# EAGLE design FioSwitchboard-v2 (EAGLE 5.10)
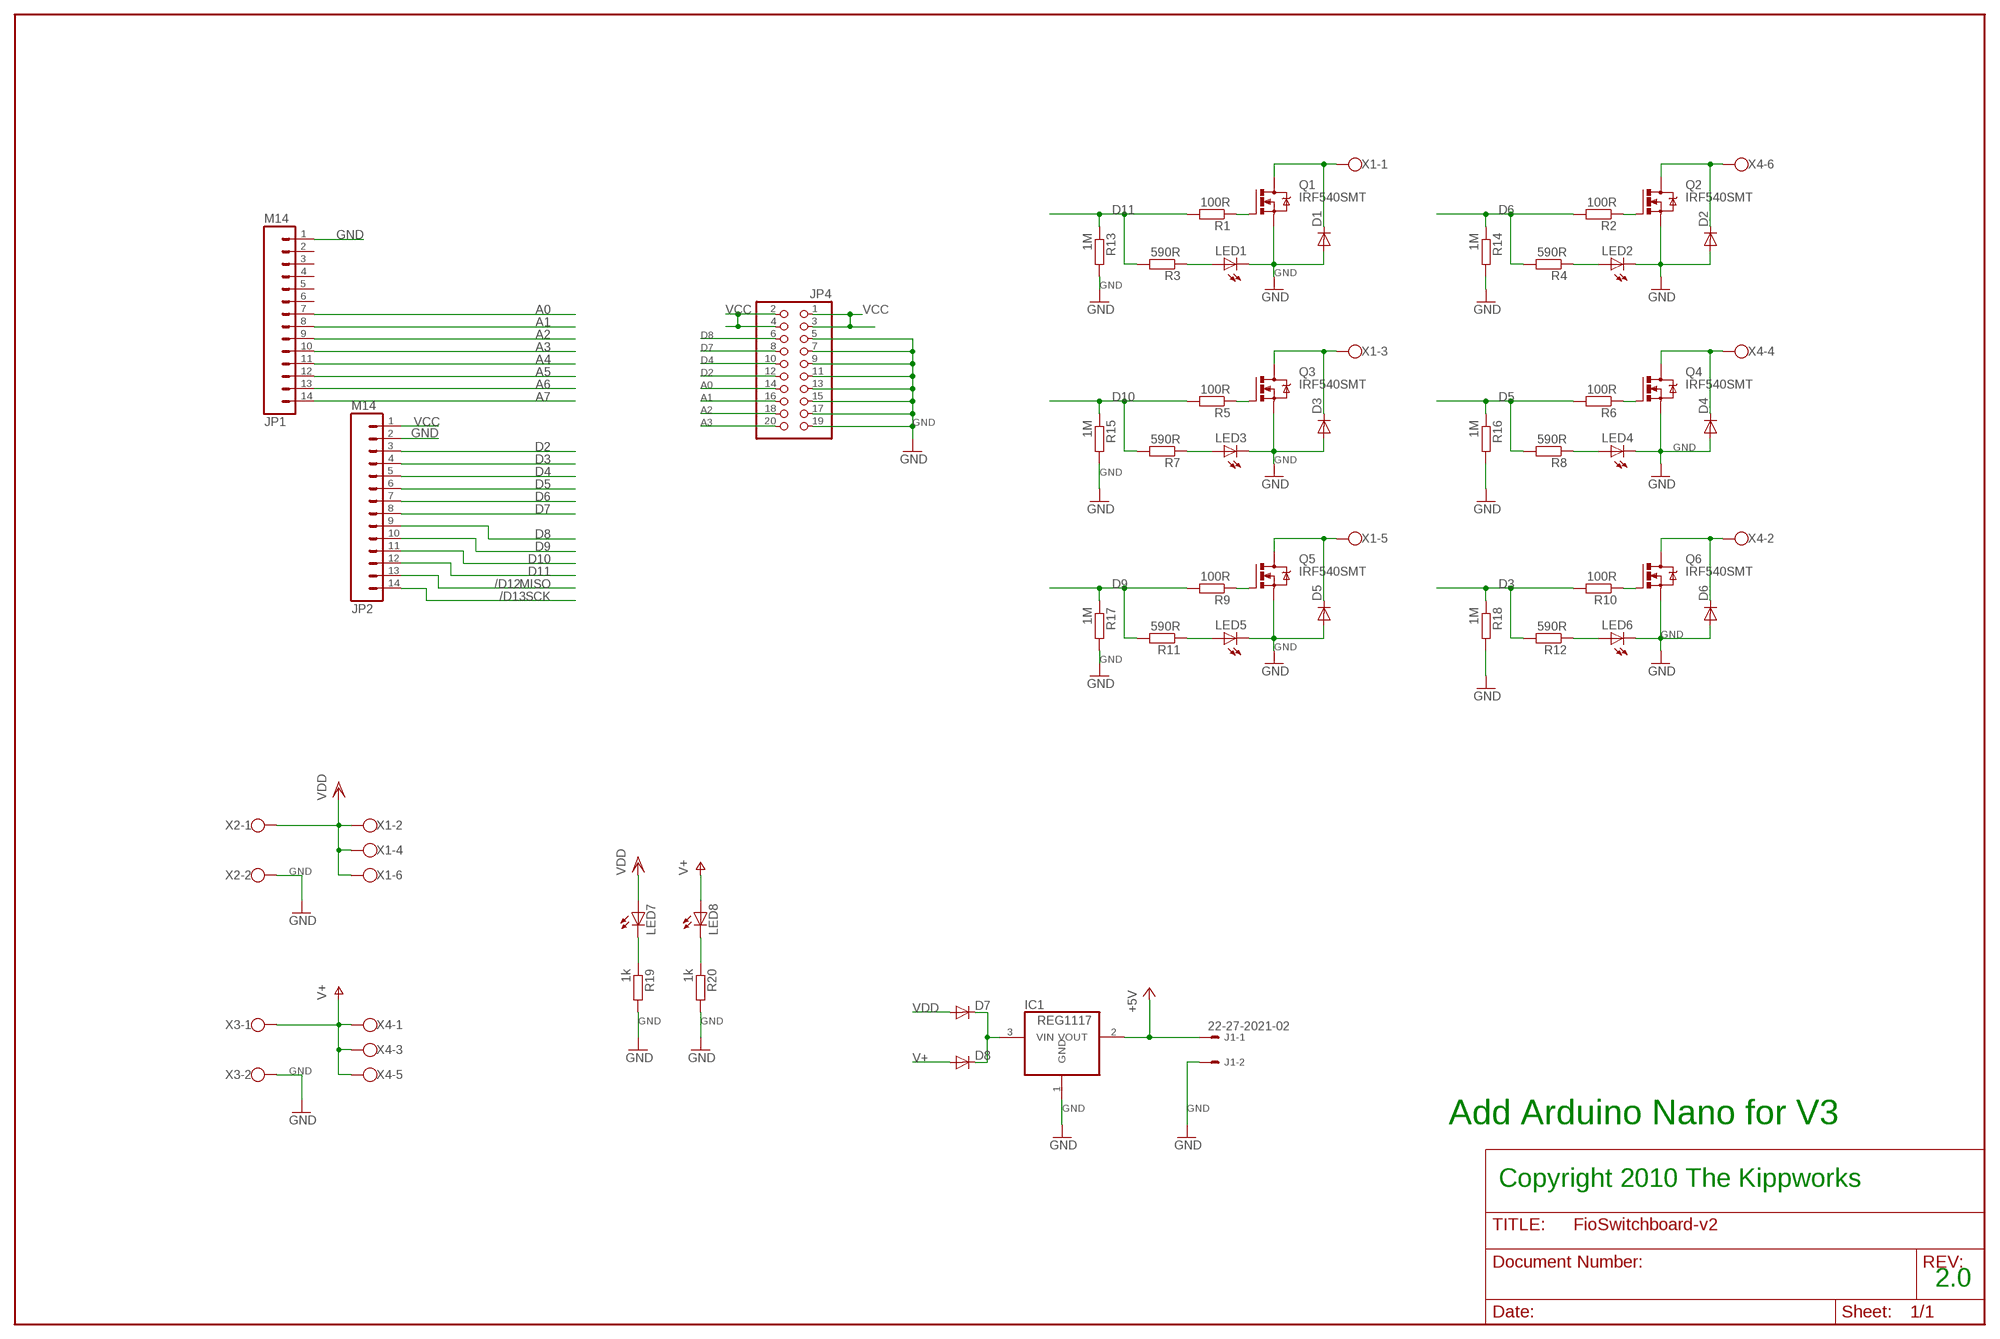
[diagram p0: schematic, sheet 1]

## Parts
D1  DIODE-DO-214AC  [DO-214AC]
D2  DIODE-DO-214AC  [DO-214AC]
D3  DIODE-DO-214AC  [DO-214AC]
D4  DIODE-DO-214AC  [DO-214AC]
D5  DIODE-DO-214AC  [DO-214AC]
D6  DIODE-DO-214AC  [DO-214AC]
D7  DIODE-MICROMELF-R  [MICROMELF-R]
D8  DIODE-MICROMELF-R  [MICROMELF-R]
IC1  REG1117  [SOT223]
J1  22-27-2021-02  [6410-02]
JP1  M14  [1X14]
JP2  M14  [1X14]
JP4  PINHD-2X10  [2X10]
LED1  LEDCHIP-LED0805  [CHIP-LED0805]
LED2  LEDCHIP-LED0805  [CHIP-LED0805]
LED3  LEDCHIP-LED0805  [CHIP-LED0805]
LED4  LEDCHIP-LED0805  [CHIP-LED0805]
LED5  LEDCHIP-LED0805  [CHIP-LED0805]
LED6  LEDCHIP-LED0805  [CHIP-LED0805]
LED7  LEDCHIP-LED0805  [CHIP-LED0805]
LED8  LEDCHIP-LED0805  [CHIP-LED0805]
Q1  IRF540SMT  IRF540SMT252  [D-PAK_TO252AA]
Q2  IRF540SMT  IRF540SMT252  [D-PAK_TO252AA]
Q3  IRF540SMT  IRF540SMT252  [D-PAK_TO252AA]
Q4  IRF540SMT  IRF540SMT252  [D-PAK_TO252AA]
Q5  IRF540SMT  IRF540SMT252  [D-PAK_TO252AA]
Q6  IRF540SMT  IRF540SMT252  [D-PAK_TO252AA]
R1  100R  R-EU_R0603  [R0603]
R2  100R  R-EU_R0603  [R0603]
R3  590R  R-EU_R0603  [R0603]
R4  590R  R-EU_R0603  [R0603]
R5  100R  R-EU_R0603  [R0603]
R6  100R  R-EU_R0603  [R0603]
R7  590R  R-EU_R0603  [R0603]
R8  590R  R-EU_R0603  [R0603]
R9  100R  R-EU_R0603  [R0603]
R10  100R  R-EU_R0603  [R0603]
R11  590R  R-EU_R0603  [R0603]
R12  590R  R-EU_R0603  [R0603]
R13  1M  R-EU_R0603  [R0603]
R14  1M  R-EU_R0603  [R0603]
R15  1M  R-EU_R0603  [R0603]
R16  1M  R-EU_R0603  [R0603]
R17  1M  R-EU_R0603  [R0603]
R18  1M  R-EU_R0603  [R0603]
R19  1k  R-EU_R0603  [R0603]
R20  1k  R-EU_R0603  [R0603]
X1  W237-136  [W237-136]
X2  W237-102  [W237-102]
X3  W237-102  [W237-102]
X4  W237-136  [W237-136]

## Nets
+5V: IC1.2(VOUT) J1.1
A0: JP1.7 JP4.14
A1: JP1.8 JP4.16
A2: JP1.9 JP4.18
A3: JP1.10 JP4.20
A4: JP1.11
A5: JP1.12
A6: JP1.13
A7: JP1.14
D2: JP2.3 JP4.12
D3: JP2.4 R10.2 R12.2 R18.1
D4: JP2.5 JP4.10
D5: JP2.6 R6.2 R8.2 R16.1
D6: JP2.7 R2.2 R4.2 R14.1
D7: JP2.8 JP4.8
D8: JP2.9 JP4.6
D9: JP2.10 R9.2 R11.2 R17.1
D10: JP2.11 R5.2 R7.2 R15.1
D11: JP2.12 R1.2 R3.2 R13.1
GND: D1.A D2.A D3.A D4.A D5.A D6.A IC1.1(GND) J1.2 JP1.1 JP2.2 JP4.5 JP4.7 JP4.9 JP4.11 JP4.13 JP4.15 JP4.17 JP4.19 LED1.C LED2.C LED3.C LED4.C LED5.C LED6.C Q1.3(S) Q2.3(S) Q3.3(S) Q4.3(S) Q5.3(S) Q6.3(S) R13.2 R14.2 R15.2 R16.2 R17.2 R18.2 R19.2 R20.2 X2.2 X3.2
MISO: JP2.13
N$1: Q3.1(G) R5.1
N$2: Q5.1(G) R9.1
N$3: D2.C Q2.4(D) X4.6
N$4: LED2.A R4.1
N$5: Q6.1(G) R10.1
N$6: D3.C Q3.4(D) X1.3
N$7: LED3.A R7.1
N$8: Q4.1(G) R6.1
N$9: D4.C Q4.4(D) X4.4
N$10: LED4.A R8.1
N$11: Q2.1(G) R2.1
N$12: D5.C Q5.4(D) X1.5
N$13: LED5.A R11.1
N$14: D1.C Q1.4(D) X1.1
N$15: Q1.1(G) R1.1
N$16: LED1.A R3.1
N$17: D6.C Q6.4(D) X4.2
N$18: LED6.A R12.1
N$19: D7.C D8.C IC1.3(VIN)
N$20: LED7.C R19.1
N$21: LED8.C R20.1
SCK: JP2.14
V+: D8.A LED8.A X3.1 X4.1 X4.3 X4.5
VCC [VCC]: JP2.1 JP4.1 JP4.2 JP4.3 JP4.4
VDD: D7.A LED7.A X1.2 X1.4 X1.6 X2.1
Unconnected: JP1.2 JP1.3 JP1.4 JP1.5 JP1.6

## Notes on the sheet
- /D12
- /D13
- Add Arduino Nano for V3
- Copyright 2010 The Kippworks
- 2.0

## Library data of the parts
D1-D8 = diode:DIODE-: DIODE
IC1 = burr-brown:REG1117: 800mA and 1A Low Dropout (LDO) Positive Regulator 1.8V, 2.5V, 2.85V, 3.3V, 5V, and Adj
J1 = con-molex:22-?-02: CONNECTOR wire to board 2.54 mm (.1 inch) pitch header
JP1 JP2 = SparkFun:M14: Header 14 Standard 14-pin 0.1" header. Use with straight break away headers (SKU : PRT-00116), right angle break away headers (PRT-00553), swiss pins (PRT-00743), machine pins (PRT-00117), and female headers (PRT-00115).
JP4 = pinhead:PINHD-2X10: PIN HEADER
LED1-LED8 = led:LED: LED OSRAM: - CHIPLED LG R971, LG N971, LY N971, LG Q971, LY Q971, LO R971, LY R971 LH N974, LH R974 LS Q976, LO Q976, LY Q976 LO Q996 - Hyper CHIPLED LW Q18S LB Q993, LB Q99A, LB R99A - SideLED LS A670, LO A670, LY A670, LG A670, LP A670 LB A673, LV A673, LT A673, LW A673 LH A674 LY A675 LS A676, LA A676, LO A676, LY A676, LW A676 LS A679, LY A679, LG A679 - Hyper Micro SIDELED® LS Y876, LA Y876, LO Y876, LY Y876 LT Y87S - SmartLED LW L88C, LW L88S LB L89C, LB L89S, LG L890 LS L89K, LO L89K, LY L89K LS L896, LA L896, LO L896, LY L896 - TOPLED LS T670, LO T670, LY T670, LG T670, LP T670 LSG T670, LSP T670, LSY T670, LOP T670, LYG T670 LG T671, LOG T671, LSG T671 LB T673, LV T673, LT T673, LW T673 LH T674 LS T676, LA T676, LO T676, LY T676, LB T676, LH T676, LSB T676, LW T676 LB T67C, LV T67C, LT T67C, LS T67K, LO T67K, LY T67K, LW E67C LS E67B, LA E67B, LO E67B, LY E67B, LB E67C, LV E67C, LT E67C LW T67C LS T679, LY T679, LG T679 LS T770, LO T770, LY T770, LG T770, LP T770 LB T773, LV T773, LT T773, LW T773 LH T774 LS E675, LA E675, LY E675, LS T675 LS T776, LA T776, LO T776, LY T776, LB T776 LHGB T686 LT T68C, LB T68C - Hyper Mini TOPLED® LB M676 - Mini TOPLED Santana® LG M470 LS M47K, LO M47K, LY M47K Source: http://www.osram.convergy.de LUXEON: - LUMILED® LXK2-PW12-R00, LXK2-PW12-S00, LXK2-PW14-U00, LXK2-PW14-V00 LXK2-PM12-R00, LXK2-PM12-S00, LXK2-PM14-U00 LXK2-PE12-Q00, LXK2-PE12-R00, LXK2-PE12-S00, LXK2-PE14-T00, LXK2-PE14-U00 LXK2-PB12-K00, LXK2-PB12-L00, LXK2-PB12-M00, LXK2-PB14-N00, LXK2-PB14-P00, LXK2-PB14-Q00 LXK2-PR12-L00, LXK2-PR12-M00, LXK2-PR14-Q00, LXK2-PR14-R00 LXK2-PD12-Q00, LXK2-PD12-R00, LXK2-PD12-S00 LXK2-PH12-R00, LXK2-PH12-S00 LXK2-PL12-P00, LXK2-PL12-Q00, LXK2-PL12-R00 Source: www.luxeon.com KINGBRIGHT: KA-3528ASYC Source: www.kingbright.com
Q1-Q6 = KippKits:IRF540: HEXFET Power MOSFET
R1-R20 = rcl:R-EU_: RESISTOR, European symbol
X1 X4 = con-wago-500:W237-136: WAGO SCREW CLAMP
X2 X3 = con-wago-500:W237-102: WAGO SCREW CLAMP

## Net classes
0 Default: width 0.203 mm
1 VCC: width 0.381 mm
2 LEDPower: width 0.203 mm
3 ButtonSignal: width 0.203 mm

## Board
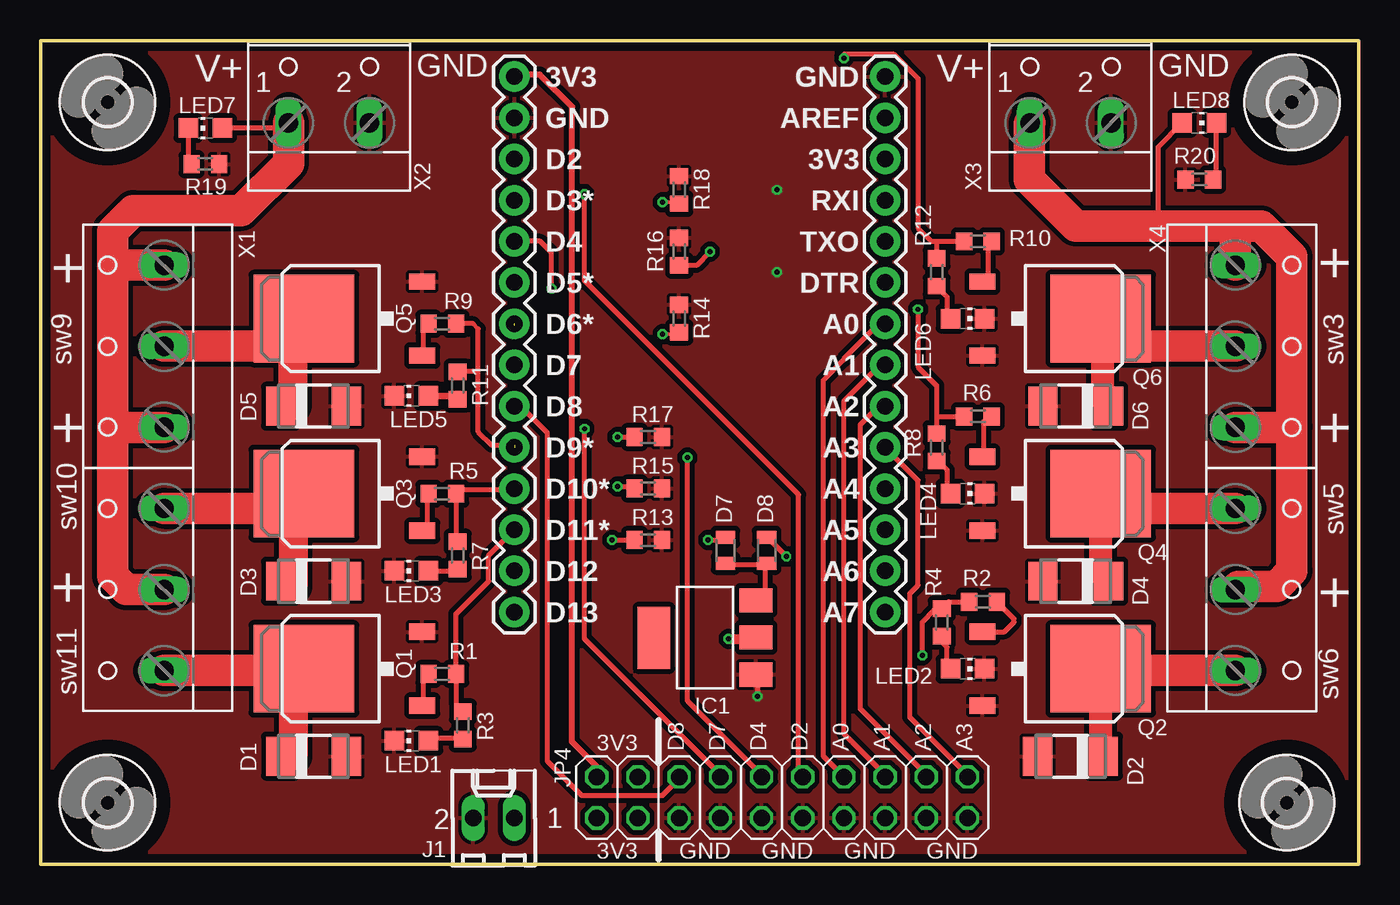
[diagram p1: board, top side]
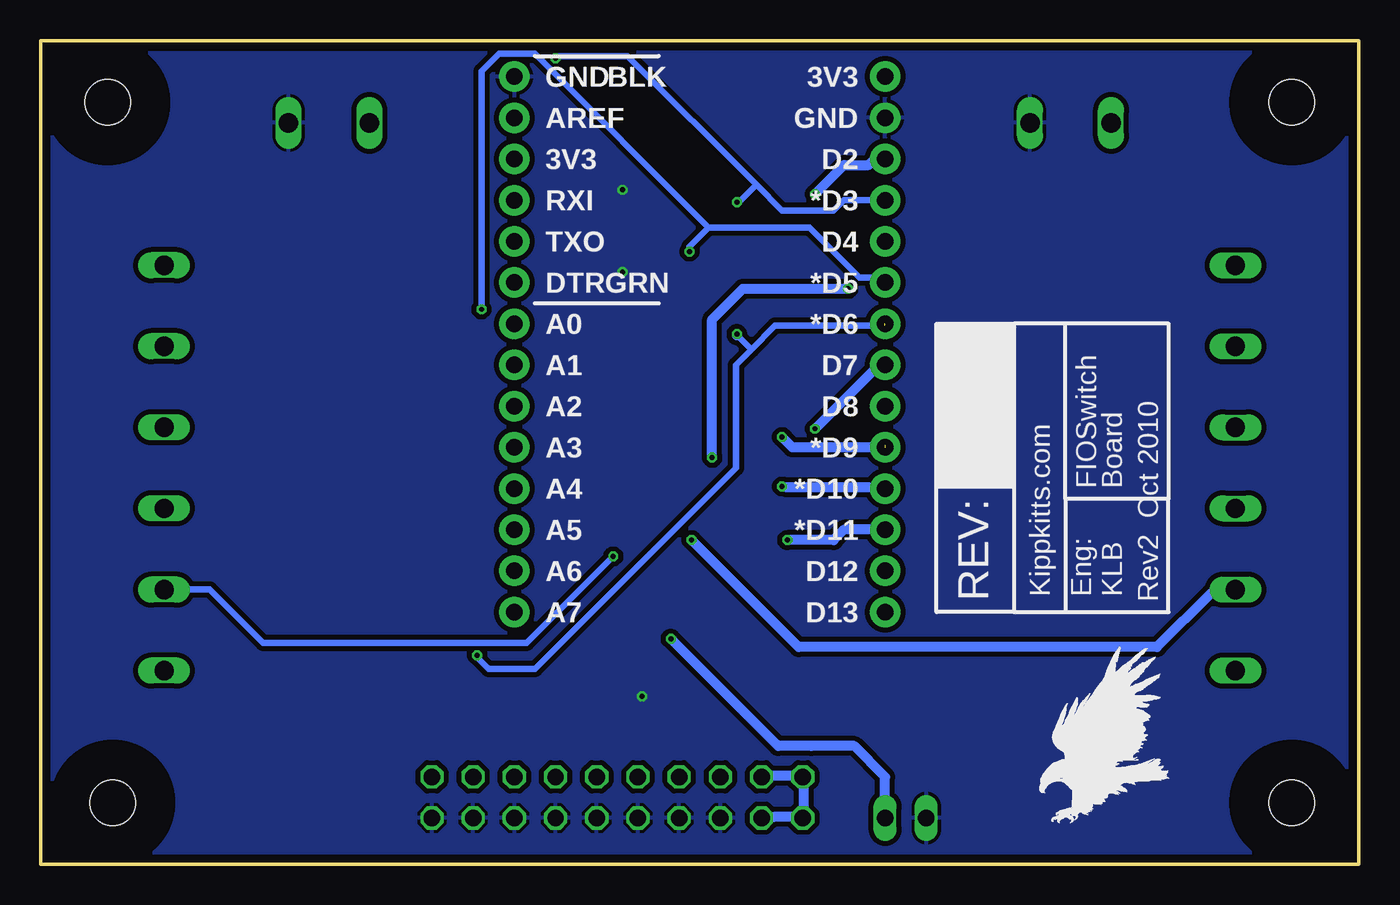
[diagram p2: board, bottom side, seen from below]

Size 81.28 x 50.8 mm. Coordinates in mm from the lower left corner, seen from the top.
Outline: 81.28,0 53.34,0 28.57,0 0,0 0,50.8 25.4,50.8 53.02,50.8 81.28,50.8 81.28,0
Copper layers (1*16): Top 0.035mm / dielectric 1.5mm / Bottom 0.035mm
Design rules: minimum track width 6mil, minimum drill 12mil, track to track 6mil, track to pad 6mil, pad to pad 6mil, via to via 6mil, smd to smd 6mil, copper to edge 20mil, drill to drill 8mil, minimum pad ring 8mil, minimum via ring 6mil, stop-mask expansion 3mil, vias tented up to drill 0mil, thermal gap 8mil

### Footprints (pad centres in the part's own frame; a part is rotated, then mirrored left to right if it is on the bottom)
DO-214AC = smd 1.8 x 2.4: A 2.025,0; C -2.025,0
MICROMELF-R = smd 0.8 x 1.2: A 0.8,0; C -0.8,0
2,8 = hole 2.8: 0,0
SOT223 = smd 1.499 x 2.007: 1 -2.261,-3.15; 2 0.025,-3.15; 3 2.311,-3.15 | smd 3.81 x 2.007: 4 0,3.15
6410-02 = drill 1.016 long: 1 1.27,0; 2 -1.27,0
1X14 = drill 1.016 pad 1.88: 1 0,0; 2 2.54,0; 3 5.08,0; 4 7.62,0; 5 10.16,0; 6 12.7,0; 7 15.24,0; 8 17.78,0; 9 20.32,0; 10 22.86,0; 11 25.4,0; 12 27.94,0; 13 30.48,0; 14 33.02,0
2X10 = drill 1.016 octagon: 1 -11.43,-1.27; 2 -11.43,1.27; 3 -8.89,-1.27; 4 -8.89,1.27; 5 -6.35,-1.27; 6 -6.35,1.27; 7 -3.81,-1.27; 8 -3.81,1.27; 9 -1.27,-1.27; 10 -1.27,1.27; 11 1.27,-1.27; 12 1.27,1.27; 13 3.81,-1.27; 14 3.81,1.27; 15 6.35,-1.27; 16 6.35,1.27; 17 8.89,-1.27; 18 8.89,1.27; 19 11.43,-1.27; 20 11.43,1.27
CHIP-LED0805 = smd 1.2 x 1.2: A 0,-1.05; C 0,1.05
D-PAK_TO252AA = smd 1 x 1.6: 1 -2.28,-4.8; 3 2.28,-4.8 | smd 5.4 x 6.2: 4 0,2.5
R0603 = smd 1 x 1.1: 1 -0.85,0; 2 0.85,0
W237-136 = drill 1.194 long: 1 -12.5,-1.27; 2 -7.5,-1.27; 3 -2.5,-1.27; 4 2.5,-1.27; 5 7.5,-1.27; 6 12.5,-1.27
W237-102 = drill 1.194 long: 1 -2.5,-1.27; 2 2.5,-1.27

### Placement (x,y rotation side)
D1  16.83,6.67 0 top
D2  63.5,6.67 180 top
D3  16.83,17.46 0 top
D4  63.82,17.46 180 top
D5  16.83,28.26 0 top
D6  63.82,28.26 180 top
D7  42.23,19.37 90 top
D8  44.77,19.37 90 top
HOLE1  [2,8]  4.13,46.99 90 top
HOLE2  [2,8]  77.15,46.99 90 top
HOLE3  [2,8]  4.13,3.81 90 top
HOLE4  [2,8]  76.84,3.81 90 top
IC1  40.96,13.97 90 top
J1  27.94,2.86 0 top
JP1  52.07,48.58 270 top
JP2  29.21,48.58 270 top
JP4  45.72,4.13 0 top
LED1  22.86,7.62 90 top
LED2  57.15,12.06 270 top
LED3  22.86,18.1 90 top
LED4  57.15,22.86 270 top
LED5  22.86,28.89 90 top
LED6  57.15,33.66 270 top
LED7  10.16,45.4 90 top
LED8  71.44,45.72 270 top
Q1  18.73,12.06 90 top
Q2  62.86,12.06 270 top
Q3  18.73,22.86 90 top
Q4  62.86,22.86 270 top
Q5  18.73,33.66 90 top
Q6  62.86,33.66 270 top
R1  24.77,11.75 0 top
R2  58.1,16.19 180 top
R3  26.04,8.57 90 top
R4  55.56,14.92 90 top
R5  24.77,22.86 0 top
R6  57.78,27.62 180 top
R7  25.72,19.05 90 top
R8  55.24,25.72 90 top
R9  24.77,33.34 0 top
R10  57.78,38.42 180 top
R11  25.72,29.53 90 top
R12  55.24,36.51 90 top
R13  37.46,20 0 top
R14  39.37,33.66 90 top
R15  37.46,23.18 0 top
R16  39.37,37.78 90 top
R17  37.46,26.35 0 top
R18  39.37,41.59 90 top
R19  10.16,43.18 0 top
R20  71.44,42.23 180 top
U$1  [EAGLE-PLC-8MM]  19.69,2.54 0 bottom
X1  6.35,24.45 90 top
X2  17.78,46.99 0 top
X3  63.5,46.99 0 top
X4  74.93,24.45 270 top

### Tracks (layer width: path | path; a pad name or v marks a point on that pad's centre or on a via)
+5V  (via drill 0.3)
  Top 0.203: 43.94,13.91 IC1.2
  Top 0.61: v42.42,13.91 43.94,13.91
  Bottom 0.61: v42.42,13.91 35.81,7.3 33.78,7.3 31.12,7.3 29.21,5.4 J1.1
A0
  Top 0.203: 51.56,33.21 52.07,33.21 JP1.7 | JP4.14 49.53,5.52
  Top 0.305: 51.56,33.21 49.53,31.18 49.53,31.11 48.26,29.84 48.26,6.67 JP4.14
A1
  Top 0.203: 52.07,5.52 JP4.16 | JP1.8 52.07,30.67
  Top 0.305: 52.07,5.52 50.04,7.56 49.53,8.06 49.53,28.57 51.75,30.8 JP1.8
A2
  Top 0.203: 51.56,28.13 52.07,28.13 JP1.9 | JP4.18 54.61,5.52
  Top 0.305: 54.61,5.52 50.55,9.59 50.55,27.11 51.56,28.13
A3
  Top 0.203: JP4.20 57.15,5.52 | JP1.10 52.07,25.59 JP1.10
  Top 0.305: 57.15,5.52 53.59,9.08 53.59,16.7 54.1,17.21 54.1,23.69 JP1.10
D2  (via drill 0.3)
  Top 0.203: 46.74,5.78 46.99,5.52 JP4.12
  Top 0.305: 46.74,5.78 46.74,22.8 33.53,36.01 v33.53,41.34
  Bottom 0.203: 29.21,43.37 JP2.3
  Bottom 0.61: v33.53,41.34 31.75,43.12 30.23,43.12 29.97,43.37 29.21,43.37
D3  (via drill 0.3)
  Top 0.203: v38.35,40.83 39.37,40.83 R18.1 | v49.53,49.72 49.53,49.97
  Top 0.254: 54.1,39.31 54.1,39.24
  Top 0.305: 54.1,39.31 54.1,48.45 52.58,49.97 49.53,49.97 | 54.1,39.24 54.93,38.42 55.24,38.42 | 55.24,38.42 R10.2 | 55.24,38.42 R12.2
  Bottom 0.406: JP2.4 31.75,40.96 32.39,40.32 35.56,40.32 37.15,41.91 | 37.15,41.91 45.09,49.85 49.4,49.85 v49.53,49.72 | v38.35,40.83 38.23,40.83 37.15,41.91
D4  (via drill 0.3)
  Top 0.203: 44.45,5.52 JP4.10
  Top 0.305: 44.45,5.52 39.88,10.1 v39.88,25.08 | v31.5,35.5 31.5,37.72 30.8,38.42 JP2.5
  Bottom 0.61: v39.88,25.08 39.88,33.6 37.98,35.5 v31.5,35.5
D5  (via drill 0.3)
  Top 0.203: R8.2 55.37,26.61 | 56.9,27.62 R6.2
  Top 0.305: R16.1 40.42,36.93 v41.28,37.78 | v54.1,34.23 54.1,30.67 55.24,29.53 55.24,27.62 | 55.24,27.62 R8.2 | 55.24,27.62 56.9,27.62
  Bottom 0.406: v54.1,34.23 54.1,48.9 53.02,49.97 50.8,49.97 40.1,39.27 | v41.28,37.78 41.28,38.1 40.1,39.27 | 40.1,39.27 33.88,39.27 30.8,36.2 29.53,36.2 JP2.6
D6  (via drill 0.3)  (1 unrouted)
  Top 0.203: v38.35,32.7 39.37,32.7 R14.1 | 55.12,15.68 R4.2
  Top 0.305: 55.12,15.68 54.36,14.92 v54.36,12.89 | R4.2 55.98,16.19 R2.2
  Bottom 0.406: 29.21,33.21 36,33.21 37.46,31.75 | 37.46,31.75 38.42,30.8 38.42,25.65 38.42,24.45 50.8,12.06 53.66,12.06 54.36,12.76 v54.36,12.89 | 37.46,31.75 38.35,32.64
  Bottom 0.61: 38.35,32.64 v38.35,32.7
D7  (via drill 0.3)
  Top 0.203: JP4.8 41.91,5.52
  Top 0.305: 41.91,5.52 33.53,13.91 v33.53,26.86
  Bottom 0.203: 29.72,30.67 29.21,30.67 JP2.8
  Bottom 0.61: v33.53,26.86 29.72,30.67
D8
  Top 0.203: 29.72,28.13 29.21,28.13 JP2.9 | 39.37,5.27 JP4.6
  Top 0.305: 39.37,5.27 38.35,4.25 33.36,4.25 31.24,6.37 31.24,26.61 29.72,28.13
D9  (via drill 0.3)  (1 unrouted)
  Top 0.203: 36.58,26.35 R17.1
  Top 0.254: 26.99,33.02 26.67,33.34 | 26.99,30.48 26.89,30.38
  Top 0.305: v35.56,26.35 36.58,26.35 | 29.21,25.84 27.81,25.84 26.99,26.67 26.99,30.48 26.99,33.02 | 26.67,33.34 R9.2 | 26.89,30.38 R11.2
  Bottom 0.61: v35.56,26.35 34.92,25.72 JP2.10
D10  (via drill 0.3)
  Top 0.203: R7.2 25.65,20 | 36.58,23.3 R15.1 | 29.21,23.11 29.21,23.05 29.21,23.11 | 29.21,23.11 JP2.11 | 25.65,23.11 R5.2 25.65,23.11
  Top 0.305: 25.65,20 25.65,23.11 29.21,23.11 | v35.56,23.3 36.58,23.3
  Bottom 0.203: 35.31,23.24 v35.56,23.3 | 30.23,23.24 29.97,23.3 29.21,23.3 JP2.11
  Bottom 0.61: 30.23,23.24 35.31,23.24
D11  (via drill 0.3)
  Top 0.203: 25.65,9.84 25.91,9.59 R3.2 | 25.65,11.62 R1.2
  Top 0.305: 25.65,9.84 25.65,11.62 | v35.24,20 R13.1 | R1.2 25.62,15.46 27.62,17.46 27.62,19.05 JP2.12
  Bottom 0.61: v35.24,20 32.39,20 31.75,20.64 JP2.12
GND  (via drill 0.3)
  Top 0.203: 10.92,43.12 R19.2 | IC1.1 44.2,11.62 | LED6.C 58.17,33.47 | Q6.3 58.17,31.43
  Top 0.305: 44.2,11.62 v44.2,10.35
  other vias: 45.4,36.51 45.4,41.59
  pour Bottom (isolate 0.305): 0,50.8 81.28,50.8 81.28,0 0,0
  pour Top (isolate 0.305): 0,50.8 81.28,50.8 81.28,0 0,0
N$1
  Top 0.203: 23.88,20.77 23.62,20.51 Q3.1 | 23.88,22.8 R5.1
  Top 0.305: 23.88,20.77 23.88,22.8
  Top 0.406: Q3.1 23.49,20.62
N$2
  Top 0.203: 23.62,32.96 23.88,33.21 R9.1 | Q5.1 23.62,31.43
  Top 0.305: 23.62,31.43 23.62,32.96
N$3
  Top 1.422: 65.53,13.28 Q2.4 65.37,6.83 D2.C | 65.53,13.28 65.56,13.54 | 65.53,13.28 65.79,11.95
  Top 1.93: 65.79,11.95 X4.6
N$4
  Top 0.203: 55.37,13.91 R4.1 | LED2.A 55.88,12.13
  Top 0.305: 55.37,13.91 55.88,13.4 55.88,12.13
N$5
  Top 0.203: 58.42,36.26 58.17,36.01 Q6.1 | 58.42,38.29 R10.1
  Top 0.305: 58.42,36.26 58.42,38.29
N$6
  Top 1.422: 16.19,21.95 Q3.4
  Top 1.778: Q3.4 15.56,22.86 15.56,17.14 14.8,17.14 D3.C
  Top 1.93: X1.3 16.19,21.95
N$7
  Top 0.305: LED3.A 26.03,18.1
  Top 0.406: 26.03,18.1 R7.1
N$8
  Top 0.203: 58.17,27.37 58.42,27.62 R6.1 | Q4.1 58.17,25.34
  Top 0.305: 58.17,25.34 58.17,27.37
N$9
  Top 1.422: Q4.4 65.4,23.54 | Q4.4 66.04,21.95 | Q4.4 65.37,17.94 D4.C
  Top 1.93: 66.04,21.95 X4.4
N$10
  Top 0.203: R8.1 55.37,24.83 | 55.88,23.05 LED4.A
  Top 0.305: 55.37,24.83 55.88,24.32 55.88,23.05
N$11
  Top 0.305: R2.1 60.01,15.14 60.01,14.92 59.43,14.35 Q2.1
N$12
  Top 1.422: 16.11,31.95 Q5.4 | 15.56,28.28 D5.C
  Top 1.778: 16.11,31.95 15.56,33.53 15.56,28.28
  Top 1.93: X1.5 16.11,31.95
N$13
  Top 0.406: LED5.A 26.03,28.89 R11.1
N$14
  Top 1.422: 16.35,11.95 Q1.4
  Top 1.778: Q1.4 15.56,12.06 15.56,6.67 D1.C
  Top 1.93: X1.1 16.35,11.95
N$15
  Top 0.203: 23.62,11.37 23.88,11.62 R1.1 | Q1.1 23.62,9.84
  Top 0.305: 23.62,9.84 23.62,11.37
N$16
  Top 0.203: 25.91,7.81 R3.1 | LED1.A 24.13,7.81
  Top 0.305: 24.13,7.81 25.91,7.81
N$17
  Top 1.422: Q6.4 65.48,31.95 65.48,28.61 D6.C
  Top 1.93: 65.48,31.95 X4.2
N$18
  Top 0.203: 55.37,35.5 R12.1 | 55.88,33.72 LED6.A
  Top 0.305: 55.37,35.5 55.88,34.99 55.88,33.72
N$19
  Top 0.203: 42.42,18.48 D7.C | 44.7,16.95 44.2,16.45 IC1.3 | 44.7,18.48 D8.C 44.7,18.48
  Top 0.305: 42.42,18.48 44.7,18.48 44.7,16.95
N$20
  Top 0.203: R19.1 9.14,43.37 | 9.14,45.4 LED7.C
  Top 0.305: 9.14,43.37 9.14,45.4
N$21
  Top 0.305: R20.1 72.49,42.43 LED8.C
V+  (via drill 0.3)
  Top 0.203: D8.A 44.96,20
  Top 0.305: 44.96,20 v45.97,18.99 | LED8.A 68.9,44.23 68.9,40.01 68.9,39.37
  Top 1.422: X4.5 73.86,17.14 | 77.15,26.99 77.11,26.95 | 73.98,39.37 73.66,39.05
  Top 1.93: 73.86,17.14 76.2,17.14 77.15,18.1 77.15,26.99 77.15,37.47 75.25,39.37 73.98,39.37 73.66,39.37 68.9,39.37 64.45,39.37 63.82,39.37 60.96,42.23 60.96,45.68 X3.1 | 77.11,26.95 X4.3 | 73.66,39.05 X4.1
  Bottom 0.203: X4.5
  Bottom 0.406: v45.97,18.99 51.31,13.65 67.56,13.65 70.87,16.95 X4.5
VCC
  Top 0.381: 32.77,46.71 32.77,7.56 34.29,6.03 34.29,5.52 JP4.2 | 30.77,48.7 29.21,48.7 JP2.1
  Top 0.406: 32.77,46.71 30.77,48.7
  Bottom 0.381: 36.07,2.92 36.32,2.98 36.83,2.98 JP4.3 | 34.54,5.46 34.29,5.52 JP4.2 34.29,5.27 34.23,5.27 | 36.07,5.46 36.32,5.52 36.83,5.52 JP4.4 | 34.29,2.98 34.23,2.92 JP4.1 34.29,2.98
  Bottom 0.61: 36.07,2.92 34.23,2.92 34.23,5.27 | 34.54,5.46 36.07,5.46
VDD  (via drill 0.3)
  Top 0.203: 11.43,45.4 LED7.A | 15.28,45.4 14.48,45.4 | 42.16,20 D7.A
  Top 0.305: 14.48,45.4 11.43,45.4 | v41.15,20 42.16,20
  Top 1.422: 4.45,37.15 4.65,36.95 | 4.45,26.99 4.49,26.95
  Top 1.93: 4.49,26.95 X1.4 | X1.2 5.28,16.95 4.45,17.78 4.45,26.99 4.45,37.15 4.45,39.05 5.71,40.32 12.38,40.32 15.28,43.22 15.28,45.4 X2.1 | 4.65,36.95 X1.6
  Bottom 0.203: 9.14,16.7 7.62,16.7 X1.2
  Bottom 0.61: v41.15,20 34.54,13.4 12.45,13.4 9.14,16.7

### Text on the board
tPlace: GND | GND | GND | V+ | 3V3 | V+ | AREF | GND | 3V3 | D2 | RXI | D3* | TXO | D4 | DTR | + | + | D5* | A0 | D6* | sw9 | A1 | sw3 | D7 | A2 | D8 | + | A3 | + | sw10 | D9* | A4 | D10* | A5 | D11* | sw5 | A6 | D12 | + | A7 | + | sw11 | D13 | sw6 | 3V3 | D8 | D7 | D4 | D2 | A0 | A1 | A2 | A3 | 3V3 | GND | GND | GND | GND
bPlace: 3V3 | BLK | GND | GND | AREF | D2 | 3V3 | *D3 | RXI | D4 | TXO | *D5 | GRN | DTR | *D6 | A0 | D7 | A1 | D8 | A2 | *D9 | A3 | *D10 | Board | FIOSwitch | REV: | A4 | *D11 | A5 | D12 | KLB | Eng: | Kippkitts.com | A6 | Rev2 Oct 2010 | D13 | A7